# Altium schematic sheet 07_Indicators.SchDoc: Indicators
size A4; SheetNumber: 8; SheetTotal: 10
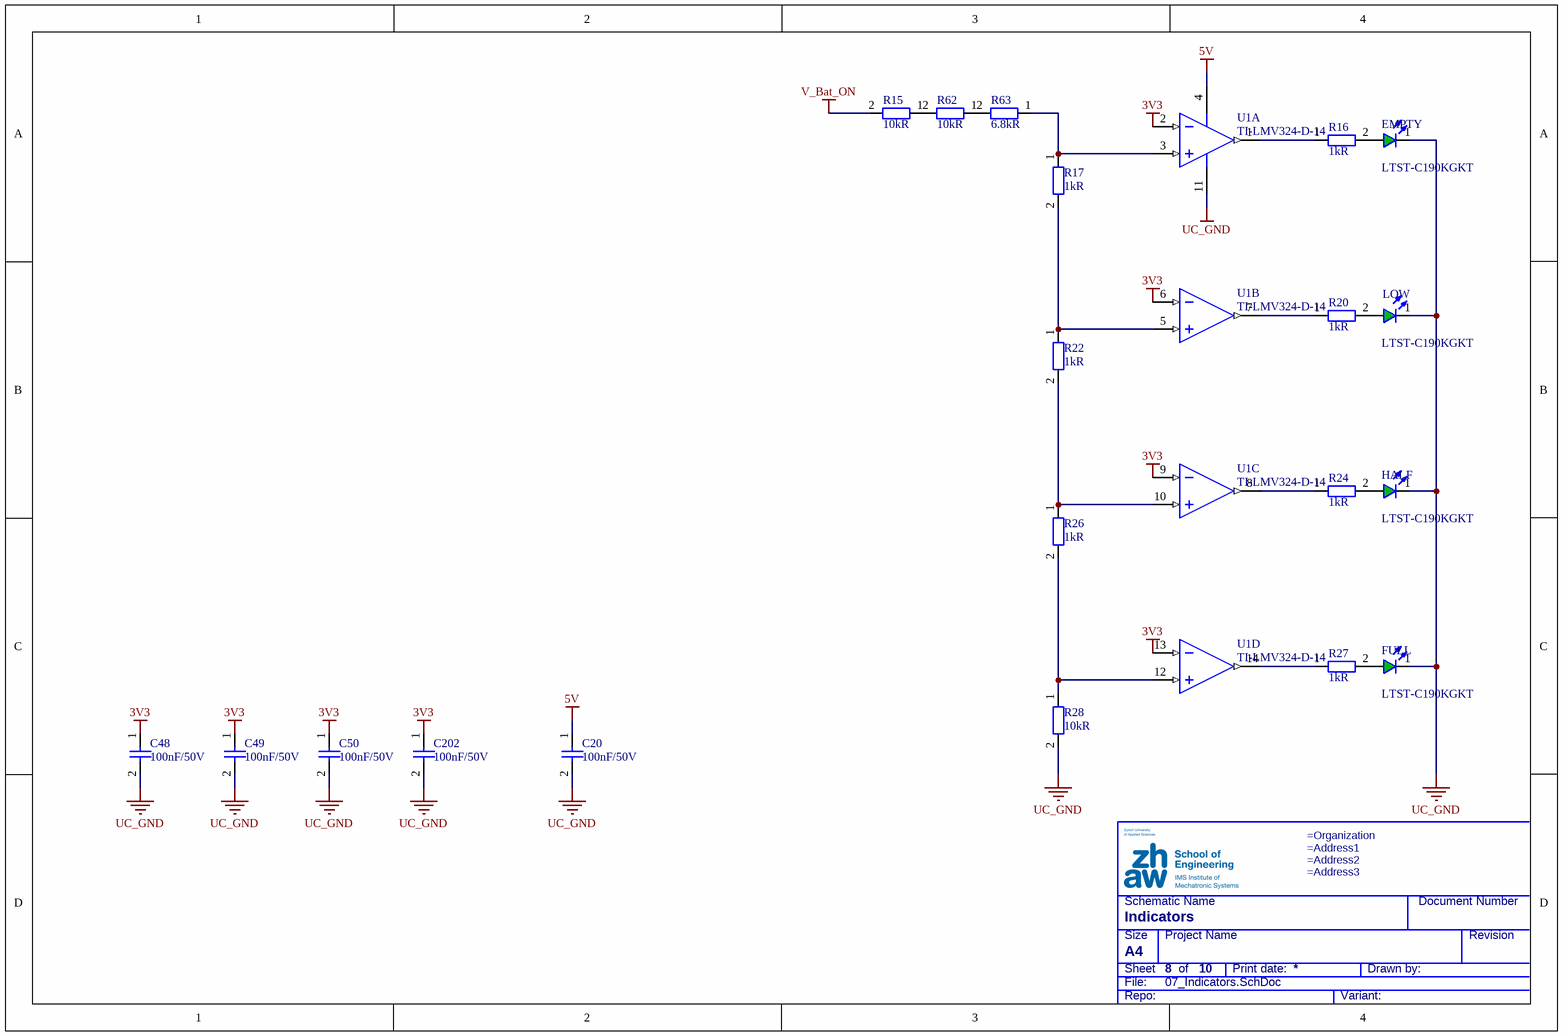
[diagram p0: 07_Indicators.SchDoc]

## Parts
C20  100nF/50V  [CAPC1005X05L]
C48  100nF/50V  [CAPC1005X05L]
C49  100nF/50V  [CAPC1005X05L]
C50  100nF/50V  [CAPC1005X05L]
C202  100nF/50V  [CAPC1005X05L]
EMPTY  LTST-C190KGKT  [LEDSC160X80X80-2Lgn]
FULL  LTST-C190KGKT  [LEDSC160X80X80-2Lgn]
HALF  LTST-C190KGKT  [LEDSC160X80X80-2Lgn]
LOW  LTST-C190KGKT  [LEDSC160X80X80-2Lgn]
R15  10kR  [RESC1005X04L]
R16  1kR  [RESC1005X04L]
R17  1kR  [RESC1005X04L]
R20  1kR  [RESC1005X04L]
R22  1kR  [RESC1005X04L]
R24  1kR  [RESC1005X04L]
R26  1kR  [RESC1005X04L]
R27  1kR  [RESC1005X04L]
R28  10kR  [RESC1005X04L]
R62  10kR  [RESC1005X04L]
R63  6.8kR  [RESC1005X04L]
U1  TI-LMV324-D-14  [D0014A_V]  (parts A,B,C,D of 4)

## Nets
3V3: C48.1 C49.1 C50.1 C202.1 U1.2(1IN-) U1.6(2IN-) U1.9(3IN-) U1.13(4IN-)
5V: C20.1 U1.4(VCC+)
UC_GND: C20.2 C48.2 C49.2 C50.2 C202.2 EMPTY.1(K) FULL.1(K) HALF.1(K) LOW.1(K) R28.2 U1.11(GND)
V_Bat_ON: R15.2
NetEMPTY_2: EMPTY.2(A) R16.2
NetFULL_2: FULL.2(A) R27.2
NetHALF_2: HALF.2(A) R24.2
NetLOW_2: LOW.2(A) R20.2
NetR15_1: R15.1 R62.2
NetR16_1: R16.1 U1.1(1OUT)
NetR17_1: R17.1 R63.1 U1.3(1IN+)
NetR17_2: R17.2 R22.1 U1.5(2IN+)
NetR20_1: R20.1 U1.7(2OUT)
NetR22_2: R22.2 R26.1 U1.10(3IN+)
NetR24_1: R24.1 U1.8(3OUT)
NetR26_2: R26.2 R28.1 U1.12(4IN+)
NetR27_1: R27.1 U1.14(4OUT)
NetR62_1: R62.1 R63.2

## Notes on the sheet
- Schematic Name
- Document Number
- File:
- Sheet
- Size
- A4
- Project Name
- of
- Print date:
- Drawn by:
- Revision
- Repo:
- Variant:

## Library data of the parts
C20 C48-C50 C202 = CMP-001-00067-18: Cap MLCC, 100nF, 50V, X7R, 10%, 0402; Value: 100nF; Case/Package: 0402; Case Code (Metric): 1005; Dielectricum: X7R; Mounting Technology: SMD; Tolerance: 10%; Type: MLCC; Voltage Rating: 50V
EMPTY FULL HALF LOW = CMP-007-00002-10: LED, Green, 20mA, 2.0V, 0603; Forward Voltage: 2V; Wavelength: 571nm; Case/Package: 0603; Color: Green; Mounting Technology: SMD; Rated Current: 20mA; Size: 1.1mm
R15 R28 R62 = CMP-009-00149-32: Res, 10kR, 1%, 0.1W, 0402; Value: 10k; Power: 100mW; Voltage Rating: 50V; Case/Package: 0402; Case Code (Metric): 1005; Mounting Technology: SMD; Tolerance: 1%; Type: Fixed
R16 R17 R20 R22 R24 R26 R27 = CMP-009-00009-32: Res, 1kR, 1%, 0.1W, 0402; Value: 1k; Power: 100mW; Voltage Rating: 50V; Case/Package: 0402; Case Code (Metric): 1005; Mounting Technology: SMD; Tolerance: 1%; Type: Fixed
R63 = CMP-009-00180-22: Res, 6.8kR, 1%, 0.063W, 0402; Value: 6.8k; Power: 63mW; Voltage Rating: 50V; Case/Package: 0402; Case Code (Metric): 1005; Mounting Technology: SMD; Tolerance: 1%; Type: Fixed
U1 = CMP-014-00025-8: OP 4 Ch, 2.7..5.5V, 1MHz, 1V/us, R2R: Out, SOIC-14; Channels: 4; CMRR: 63dB; Input Bias Current: 11nA; Input Noise (1/sqr(Hz)): 39nV @ 1kHz; Input Offset Voltage: 1.7mV; Max Supply Voltage: 5V; Min Supply Voltage: 2.7V; Quiescent Current / Ch: 102uA @ 5V; Case/Package: SOIC-14; Function: OP; GBW: 1MHz; Mounting Technology: SMD; Rail-to-Rail: Out; Slew Rate (V/us): 1V/us